# EAGLE schematic RC_Transmitter_TX_FINAL_v4.4 (EAGLE 9.7.0)
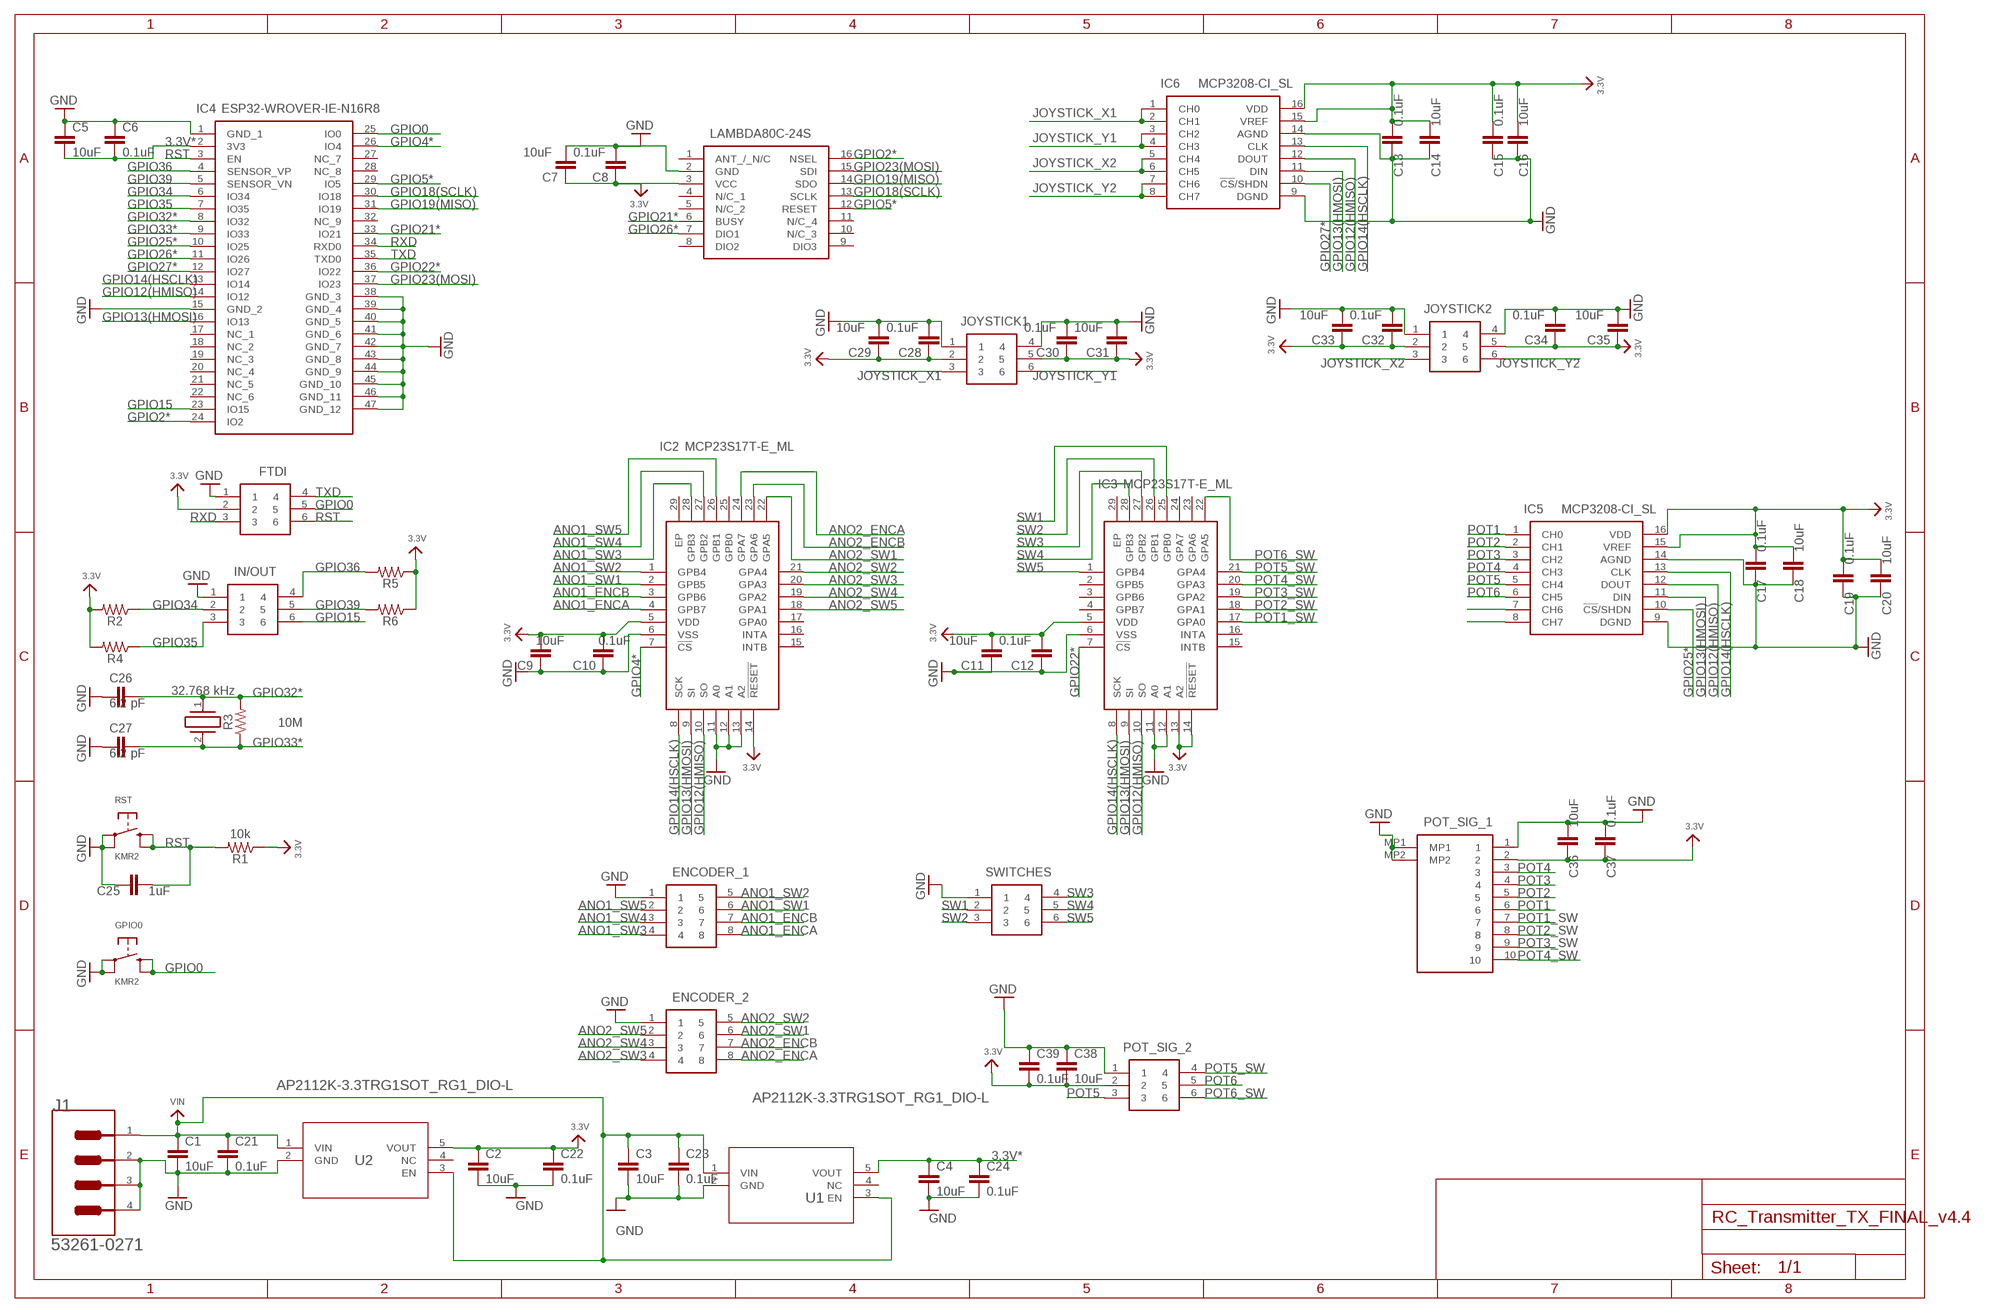
[diagram p0: schematic, sheet 1]

## Parts
C1  10uF  10UF-0805-10V-10%  [0805]
C2  10uF  10UF-0805-10V-10%  [0805]
C3  10uF  10UF-0805-10V-10%  [0805]
C4  10uF  10UF-0805-10V-10%  [0805]
C5  10uF  10UF-0805-10V-10%  [0805]
C6  0.1uF  10UF-0805-10V-10%  [0805]
C7  10uF  10UF-0805-10V-10%  [0805]
C8  0.1uF  10UF-0805-10V-10%  [0805]
C9  10uF  10UF-0805-10V-10%  [0805]
C10  0.1uF  10UF-0805-10V-10%  [0805]
C11  10uF  10UF-0805-10V-10%  [0805]
C12  0.1uF  10UF-0805-10V-10%  [0805]
C13  0.1uF  10UF-0805-10V-10%  [0805]
C14  10uF  10UF-0805-10V-10%  [0805]
C15  0.1uF  10UF-0805-10V-10%  [0805]
C16  10uF  10UF-0805-10V-10%  [0805]
C17  0.1uF  10UF-0805-10V-10%  [0805]
C18  10uF  10UF-0805-10V-10%  [0805]
C19  0.1uF  10UF-0805-10V-10%  [0805]
C20  10uF  10UF-0805-10V-10%  [0805]
C21  0.1uF  10UF-0805-10V-10%  [0805]
C22  0.1uF  10UF-0805-10V-10%  [0805]
C23  0.1uF  10UF-0805-10V-10%  [0805]
C24  0.1uF  10UF-0805-10V-10%  [0805]
C25  1uF  10UF-0805-10V-10%  [0805]
C26  6.2 pF  10UF-0805-10V-10%  [0805]
C27  6.2 pF  10UF-0805-10V-10%  [0805]
C28  0.1uF  10UF-0805-10V-10%  [0805]
C29  10uF  10UF-0805-10V-10%  [0805]
C30  0.1uF  10UF-0805-10V-10%  [0805]
C31  10uF  10UF-0805-10V-10%  [0805]
C32  0.1uF  10UF-0805-10V-10%  [0805]
C33  10uF  10UF-0805-10V-10%  [0805]
C34  0.1uF  10UF-0805-10V-10%  [0805]
C35  10uF  10UF-0805-10V-10%  [0805]
C36  10uF  10UF-0805-10V-10%  [0805]
C37  0.1uF  10UF-0805-10V-10%  [0805]
C38  10uF  10UF-0805-10V-10%  [0805]
C39  0.1uF  10UF-0805-10V-10%  [0805]
CRYSTAL  32.768 kHz  ECX-.327-CDX-1293  [ECX327CDX1293]
ENCODER_1  0532610871  [53261-0871]
ENCODER_2  0532610871  [53261-0871]
FTDI  0532610671  [0532610671]
GPIO0  KMR2  SWITCH_TACT_SMT4.6X2.8  [BTN_KMR2_4.6X2.8]
IC1  LAMBDA80C-24S  [LAMBDA80C24S]
IC2  MCP23S17T-E_ML  [QFN65P600X600X100-29N]
IC3  MCP23S17T-E_ML  [QFN65P600X600X100-29N]
IC4  ESP32-WROVER-IE-N16R8  [ESP32WROVERIEN16R8]
IC5  MCP3208-CI_SL  [SOIC127P600X175-16N]
IC6  MCP3208-CI_SL  [SOIC127P600X175-16N]
IN/OUT  0532610671  [0532610671]
J1  MOLEX_53261-0271MOLEX_53261-0271_0_0  [MOLEX_53261-0271_0]
JOYSTICK1  0532610671  [0532610671]
JOYSTICK2  0532610671  [0532610671]
POT_SIG_1  0532611071  [0532611071]
POT_SIG_2  0532610671  [0532610671]
R1  10k  0OHM-0603-1/10W-5%  [0603]
R2  10k  0OHM-0603-1/10W-5%  [0603]
R3  10M  0OHM-0603-1/10W-5%  [0603]
R4  10k  0OHM-0603-1/10W-5%  [0603]
R5  10k  0OHM-0603-1/10W-5%  [0603]
R6  10k  0OHM-0603-1/10W-5%  [0603]
RST  KMR2  SWITCH_TACT_SMT4.6X2.8  [BTN_KMR2_4.6X2.8]
SWITCHES  0532610671  [0532610671]
U1  AP2112K-3.3TRG1SOT_RG1_DIO-L  [SOT_RG1_DIO-L]
U2  AP2112K-3.3TRG1SOT_RG1_DIO-L  [SOT_RG1_DIO-L]

## Nets
3.3V: C2.1 C7.1 C8.1 C9.2 C10.2 C11.2 C12.2 C13.2 C14.2 C15.2 C16.2 C17.2 C18.2 C19.2 C20.2 C22.1 C28.1 C29.1 C30.1 C31.1 C32.1 C33.1 C34.1 C35.1 C36.1 C37.1 C38.2 C39.2 FTDI.2 IC1.3(VCC) IC2.5(VDD) IC2.14(!RESET) IC3.5(VDD) IC3.13(A2) IC3.14(!RESET) IC5.15(VREF) IC5.16(VDD) IC6.15(VREF) IC6.16(VDD) JOYSTICK1.2 JOYSTICK1.5 JOYSTICK2.2 JOYSTICK2.5 POT_SIG_1.2 POT_SIG_2.2 R1.1 R2.2 R4.2 R5.1 R6.1 U2.5(VOUT)
3.3V*: C4.1 C5.2 C6.2 C24.1 IC4.2(3V3) U1.5(VOUT)
ANO1_ENCA: ENCODER_1.8 IC2.4(GPB7)
ANO1_ENCB: ENCODER_1.7 IC2.3(GPB6)
ANO1_SW1: ENCODER_1.6 IC2.2(GPB5)
ANO1_SW2: ENCODER_1.5 IC2.1(GPB4)
ANO1_SW3: ENCODER_1.4 IC2.28(GPB3)
ANO1_SW4: ENCODER_1.3 IC2.27(GPB2)
ANO1_SW5: ENCODER_1.2 IC2.26(GPB1)
ANO2_ENCA: ENCODER_2.8 IC2.24(GPA7)
ANO2_ENCB: ENCODER_2.7 IC2.23(GPA6)
ANO2_SW1: ENCODER_2.6 IC2.22(GPA5)
ANO2_SW2: ENCODER_2.5 IC2.21(GPA4)
ANO2_SW3: ENCODER_2.4 IC2.20(GPA3)
ANO2_SW4: ENCODER_2.3 IC2.19(GPA2)
ANO2_SW5: ENCODER_2.2 IC2.18(GPA1)
GND: C1.2 C2.2 C3.2 C4.2 C5.1 C6.1 C7.2 C8.2 C9.1 C10.1 C11.1 C12.1 C13.1 C14.1 C15.1 C16.1 C17.1 C18.1 C19.1 C20.1 C21.2 C22.2 C23.2 C24.2 C25.1 C26.1 C27.1 C28.2 C29.2 C30.2 C31.2 C32.2 C33.2 C34.2 C35.2 C36.2 C37.2 C38.1 C39.1 ENCODER_1.1 ENCODER_2.1 FTDI.1 GPIO0.A'(P1) GPIO0.A(P) IC1.2(GND) IC2.6(VSS) IC2.11(A0) IC2.12(A1) IC2.13(A2) IC3.6(VSS) IC3.11(A0) IC3.12(A1) IC4.1(GND_1) IC4.15(GND_2) IC4.38(GND_3) IC4.39(GND_4) IC4.40(GND_5) IC4.41(GND_6) IC4.42(GND_7) IC4.43(GND_8) IC4.44(GND_9) IC4.45(GND_10) IC4.46(GND_11) IC4.47(GND_12) IC5.9(DGND) IC5.14(AGND) IC6.9(DGND) IC6.14(AGND) IN/OUT.1 J1.2 J1.3(MNT_1) J1.4(MNT_2) JOYSTICK1.1 JOYSTICK1.4 JOYSTICK2.1 JOYSTICK2.4 POT_SIG_1.1 POT_SIG_1.MP1 POT_SIG_1.MP2 POT_SIG_2.1 RST.A'(P1) RST.A(P) SWITCHES.1 U1.2(GND) U2.2(GND)
GPIO0: FTDI.5 GPIO0.B'(S1) GPIO0.B(S) IC4.25(IO0)
GPIO2*: IC1.16(NSEL) IC4.24(IO2)
GPIO4*: IC2.7(!CS) IC4.26(IO4)
GPIO5*: IC1.12(RESET) IC4.29(IO5)
GPIO12(HMISO): IC2.10(SO) IC3.10(SO) IC4.14(IO12) IC5.12(DOUT) IC6.12(DOUT)
GPIO13(HMOSI): IC2.9(SI) IC3.9(SI) IC4.16(IO13) IC5.11(DIN) IC6.11(DIN)
GPIO14(HSCLK): IC2.8(SCK) IC3.8(SCK) IC4.13(IO14) IC5.13(CLK) IC6.13(CLK)
GPIO15: IC4.23(IO15) IN/OUT.6
GPIO18(SCLK): IC1.13(SCLK) IC4.30(IO18)
GPIO19(MISO): IC1.14(SDO) IC4.31(IO19)
GPIO21*: IC1.6(BUSY) IC4.33(IO21)
GPIO22*: IC3.7(!CS) IC4.36(IO22)
GPIO23(MOSI): IC1.15(SDI) IC4.37(IO23)
GPIO25*: IC4.10(IO25) IC5.10(!CS!/SHDN)
GPIO26*: IC1.7(DIO1) IC4.11(IO26)
GPIO27*: IC4.12(IO27) IC6.10(!CS!/SHDN)
GPIO32*: C26.2 CRYSTAL.1(X1) IC4.8(IO32) R3.2
GPIO33*: C27.2 CRYSTAL.2(X2) IC4.9(IO33) R3.1
GPIO34: IC4.6(IO34) IN/OUT.2 R2.1
GPIO35: IC4.7(IO35) IN/OUT.3 R4.1
GPIO36: IC4.4(SENSOR_VP) IN/OUT.4 R5.2
GPIO39: IC4.5(SENSOR_VN) IN/OUT.5 R6.2
JOYSTICK_X1: IC6.1(CH0) IC6.2(CH1) JOYSTICK1.3
JOYSTICK_X2: IC6.5(CH4) IC6.6(CH5) JOYSTICK2.3
JOYSTICK_Y1: IC6.3(CH2) IC6.4(CH3) JOYSTICK1.6
JOYSTICK_Y2: IC6.7(CH6) IC6.8(CH7) JOYSTICK2.6
N$9: IC5.7(CH6)
N$10: IC5.8(CH7)
POT1: IC5.1(CH0) POT_SIG_1.6
POT1_SW: IC3.17(GPA0) POT_SIG_1.7
POT2: IC5.2(CH1) POT_SIG_1.5
POT2_SW: IC3.18(GPA1) POT_SIG_1.8
POT3: IC5.3(CH2) POT_SIG_1.4
POT3_SW: IC3.19(GPA2) POT_SIG_1.9
POT4: IC5.4(CH3) POT_SIG_1.3
POT4_SW: IC3.20(GPA3) POT_SIG_1.10
POT5: IC5.5(CH4) POT_SIG_2.3
POT5_SW: IC3.21(GPA4) POT_SIG_2.4
POT6: IC5.6(CH5) POT_SIG_2.5
POT6_SW: IC3.22(GPA5) POT_SIG_2.6
RST: C25.2 FTDI.6 IC4.3(EN) R1.2 RST.B'(S1) RST.B(S)
RXD: FTDI.3 IC4.34(RXD0)
SW1: IC3.25(GPB0) SWITCHES.2
SW2: IC3.26(GPB1) SWITCHES.3
SW3: IC3.27(GPB2) SWITCHES.4
SW4: IC3.28(GPB3) SWITCHES.5
SW5: IC3.1(GPB4) SWITCHES.6
TXD: FTDI.4 IC4.35(TXD0)
VIN: C1.1 C3.1 C21.1 C23.1 J1.1 U1.1(VIN) U1.3(EN) U2.1(VIN) U2.3(EN)
Unconnected: IC1.1(ANT_/_N/C) IC1.4(N/C_1) IC1.5(N/C_2) IC1.8(DIO2) IC1.9(DIO3) IC1.10(N/C_3) IC1.11(N/C_4) IC2.15(INTB) IC2.16(INTA) IC2.17(GPA0) IC2.25(GPB0) IC2.29(EP) IC3.2(GPB5) IC3.3(GPB6) IC3.4(GPB7) IC3.15(INTB) IC3.16(INTA) IC3.23(GPA6) IC3.24(GPA7) IC3.29(EP) IC4.17(NC_1) IC4.18(NC_2) IC4.19(NC_3) IC4.20(NC_4) IC4.21(NC_5) IC4.22(NC_6) IC4.27(NC_7) IC4.28(NC_8) IC4.32(NC_9) U1.4(NC) U2.4(NC)

## Library data of the parts
C1-C5 C7 C9 C11 C14 C16 C18 C20 C29 C31 C33 C35 C36 C38 = SparkFun-Capacitors:10UF: 10.0µF ceramic capacitors A capacitor is a passive two-terminal electrical component used to store electrical energy temporarily in an electric field.; PROD_ID: CAP-11330
C6 C8 C10 C12 C13 C15 C17 C19 C21-C28 C30 C32 C34 C37 C39 = SparkFun-Capacitors:10UF: 10.0µF ceramic capacitors A capacitor is a passive two-terminal electrical component used to store electrical energy temporarily in an electric field.; PROD_ID: CAP-11330; VALUE: 10uF
CRYSTAL = ECX-.327-CDX-1293:ECX-.327-CDX-1293: Crystals 32.786kHz 12.5pF 5ppm -40C +85C Source: Datasheet <https://www.ecsxtal.com/store/pdf/ECS-.327-CDX-1293.pdf>; ARROW_PART_NUMBER: Crystal; ARROW_PRICE-STOCK: https://www.arrow.com/en/products/ecx-.327-cdx-1293/ecs-international?region=nac; DESCRIPTION: Crystals 32.786kHz 12.5pF 5ppm -40C +85C; HEIGHT: 0.9mm; MANUFACTURER_NAME: ECS; MANUFACTURER_PART_NUMBER: ECX-.327-CDX-1293; MOUSER_PART_NUMBER: 520-ECX-.327CDX-1293; MOUSER_PRICE-STOCK: https://www.mouser.co.uk/ProductDetail/ECS/ECX-.327-CDX-1293?qs=Mv7BduZupUhhIpiFqP8JVA%3D%3D
ENCODER_1 ENCODER_2 = 0532610871:0532610871: CONN HEADER 8POS 1.25MM R/A SMD Source: Datasheet <https://www.molex.com/pdm_docs/sd/532610871_sd.pdf>; ARROW_PART_NUMBER: 0532610871; ARROW_PRICE-STOCK: https://www.arrow.com/en/products/0532610871/molex?region=europe; DESCRIPTION: CONN HEADER 8POS 1.25MM R/A SMD; HEIGHT: mm; MANUFACTURER_NAME: Molex; MANUFACTURER_PART_NUMBER: 0532610871; MOUSER_PART_NUMBER: N/A; MOUSER_PRICE-STOCK: https://www.mouser.co.uk/ProductDetail/Molex/0532610871?qs=PBcRNPEHKspgmg1Yw%252BK1hQ%3D%3D
FTDI IN/OUT JOYSTICK1 JOYSTICK2 POT_SIG_2 SWITCHES = 0532610671:0532610671: 1.25mm Pitch PicoBlade Header, Surface Mount, Right Angle, 6 Circuits Source: Datasheet <http://www.molex.com/webdocs/datasheets/pdf/en-us//0532610671_PCB_HEADERS.pdf>; ARROW_PART_NUMBER: 0532610671; ARROW_PRICE-STOCK: https://www.arrow.com/en/products/0532610671/molex?region=europe; DESCRIPTION: 1.25mm Pitch PicoBlade Header, Surface Mount, Right Angle, 6 Circuits; HEIGHT: mm; MANUFACTURER_NAME: Molex; MANUFACTURER_PART_NUMBER: 0532610671; MOUSER_PART_NUMBER: N/A; MOUSER_PRICE-STOCK: https://www.mouser.co.uk/ProductDetail/Molex/0532610671?qs=PBcRNPEHKspfA5Wux0sJoA%3D%3D
GPIO0 RST = microbuilder:SWITCH_TACT_SMT: SMT Tact Switches 6x6mm - Digikey: P12940SCT-ND KMR2 (4.6x2.8mm) - Digikey: 401-1426-1-ND EVQ-PQHB55 - Light Touch, 160GF (4.5x4.5mm) - Digikey: P8090SCT-ND KMT0 - KMT021 NGJ LHS (etc.) IP68/Waterproof - Digikey: CKN10289CT-ND
IC1 = LAMBDA80C-24S:LAMBDA80C-24S: RF Transceiver FSK 3.3V 16-Pin SMD Module Source: Datasheet <https://www.arrow.com/en/products/lambda80c-24s/rf-solutions>; ARROW_PART_NUMBER: LAMBDA80C-24S; ARROW_PRICE-STOCK: https://www.arrow.com/en/products/lambda80c-24s/rf-solutions; DESCRIPTION: RF Transceiver FSK 3.3V 16-Pin SMD Module; HEIGHT: 2mm; MANUFACTURER_NAME: RF SOLUTIONS; MANUFACTURER_PART_NUMBER: LAMBDA80C-24S; MOUSER_PART_NUMBER: 223-LAMBDA80C-24S; MOUSER_PRICE-STOCK: https://www.mouser.co.uk/ProductDetail/RF-Solutions/LAMBDA80C-24S?qs=17u8i%2FzlE89dhjIrlJ9FHg%3D%3D
IC2 IC3 = MCP23S17T-E_ML:MCP23S17T-E_ML: Interface - I/O Expanders 16bit Input/Output Exp SPI interface Source: Datasheet <https://mouser.componentsearchengine.com/Datasheets/2/MCP23S17T-E_ML.pdf>; ARROW_PART_NUMBER: MCP23S17T-E/ML; ARROW_PRICE-STOCK: https://www.arrow.com/en/products/mcp23s17t-eml/microchip-technology?region=nac; DESCRIPTION: Interface - I/O Expanders 16bit Input/Output Exp SPI interface; HEIGHT: 1mm; MANUFACTURER_NAME: Microchip; MANUFACTURER_PART_NUMBER: MCP23S17T-E/ML; MOUSER_PART_NUMBER: 579-MCP23S17T-E/ML; MOUSER_PRICE-STOCK: https://www.mouser.co.uk/ProductDetail/Microchip-Technology-Atmel/MCP23S17T-E-ML?qs=usxtMOJb1RyrYiIch4BqxQ%3D%3D
IC4 = ESP32-Wrover-IE-N16R8:ESP32-WROVER-IE-N16R8: RX TXRX MOD WIFI EXT IPEX SMD Source: Datasheet <https://www.espressif.com/sites/default/files/documentation/esp32-wrover-e_esp32-wrover-ie_datasheet_en.pdf>; DESCRIPTION: RX TXRX MOD WIFI EXT IPEX SMD; HEIGHT: 3.45mm; MANUFACTURER_NAME: Espressif Systems; MANUFACTURER_PART_NUMBER: ESP32-Wrover-IE-N16R8; MOUSER_PART_NUMBER: 356-ESP32WRVIE2864UC; MOUSER_PRICE-STOCK: https://www.mouser.co.uk/ProductDetail/Espressif-Systems/ESP32-WROVER-IE-N16R8?qs=Li%252BoUPsLEnvfUqsrs3zskw%3D%3D
IC5 IC6 = MCP3208-CI_SL:MCP3208-CI_SL: 12bit A-Dconverter,MCP3208-CI/SL TSSOP16 Source: Datasheet <http://ww1.microchip.com/downloads/en/DeviceDoc/21298e.pdf>; ARROW_PART_NUMBER: MCP3208-CI/SL; ARROW_PRICE-STOCK: https://www.arrow.com/en/products/mcp3208-cisl/microchip-technology?region=nac; DESCRIPTION: 12bit A-Dconverter,MCP3208-CI/SL TSSOP16; HEIGHT: 1.75mm; MANUFACTURER_NAME: Microchip; MANUFACTURER_PART_NUMBER: MCP3208-CI/SL; MOUSER_PART_NUMBER: 579-MCP3208CISL; MOUSER_PRICE-STOCK: https://www.mouser.co.uk/ProductDetail/Microchip-Technology-Atmel/MCP3208-CI-SL?qs=BYQkrObauitTKFi1HLZPqw%3D%3D
J1 = Molex - 53261-0271:MOLEX_53261-0271: Headers & Wire Housings 1.25MM HDR 2 CKT Right-Angle; CENTROID_NOT_SPECIFIED: No; DATASHEET: http://www.molex.com/pdm_docs/sd/532610271_sd.pdf; DIGIKEY_DESCRIPTION: CONN HEADER 2POS 1.25MM R/A SMD; DIGIKEY_PART_NUMBER: WM7620CT-ND; LEAD_FREE: yes; MF: Molex; MOUSER_PART_NUMBER: 538-53261-0271; MPN: 53261-0271; PACKAGE: HDR02; PREFIX: J; ROHS: yes; TEMPERATURE_RANGE_HIGH: +85°C; TEMPERATURE_RANGE_LOW: -40°C
POT_SIG_1 = 0532611071:0532611071: Headers & Wire Housings 1.25MM HDR 10P RA SMT Source: Datasheet <https://www.molex.com/pdm_docs/sd/532611071_sd.pdf>; ARROW_PART_NUMBER: 0532611071; ARROW_PRICE-STOCK: https://www.arrow.com/en/products/0532611071/molex?region=europe; DESCRIPTION: Headers & Wire Housings 1.25MM HDR 10P RA SMT; HEIGHT: 3.4mm; MANUFACTURER_NAME: Molex; MANUFACTURER_PART_NUMBER: 0532611071; MOUSER_PART_NUMBER: N/A; MOUSER_PRICE-STOCK: https://www.mouser.co.uk/ProductDetail/Molex/0532611071?qs=PBcRNPEHKsrWtdQS0ObonQ%3D%3D
R1-R6 = SparkFun-Resistors:0OHM: 0Ω resistor A resistor is a passive two-terminal electrical component that implements electrical resistance as a circuit element. Resistors act to reduce current flow, and, at the same time, act to lower voltage levels within circuits. - Wikipedia; PROD_ID: RES-08609; VALUE: 0
U1 U2 = 2023-03-07_19-05-44_Library:AP2112K-3.3TRG1; COPYRIGHT: Copyright (C) 2023 Ultra Librarian. All rights reserved.; MANUFACTURER_PART_NUMBER: AP2112K-3.3TRG1; MFR_NAME: Diodes Inc